# EAGLE schematic schemprzes (EAGLE 7.7.0)
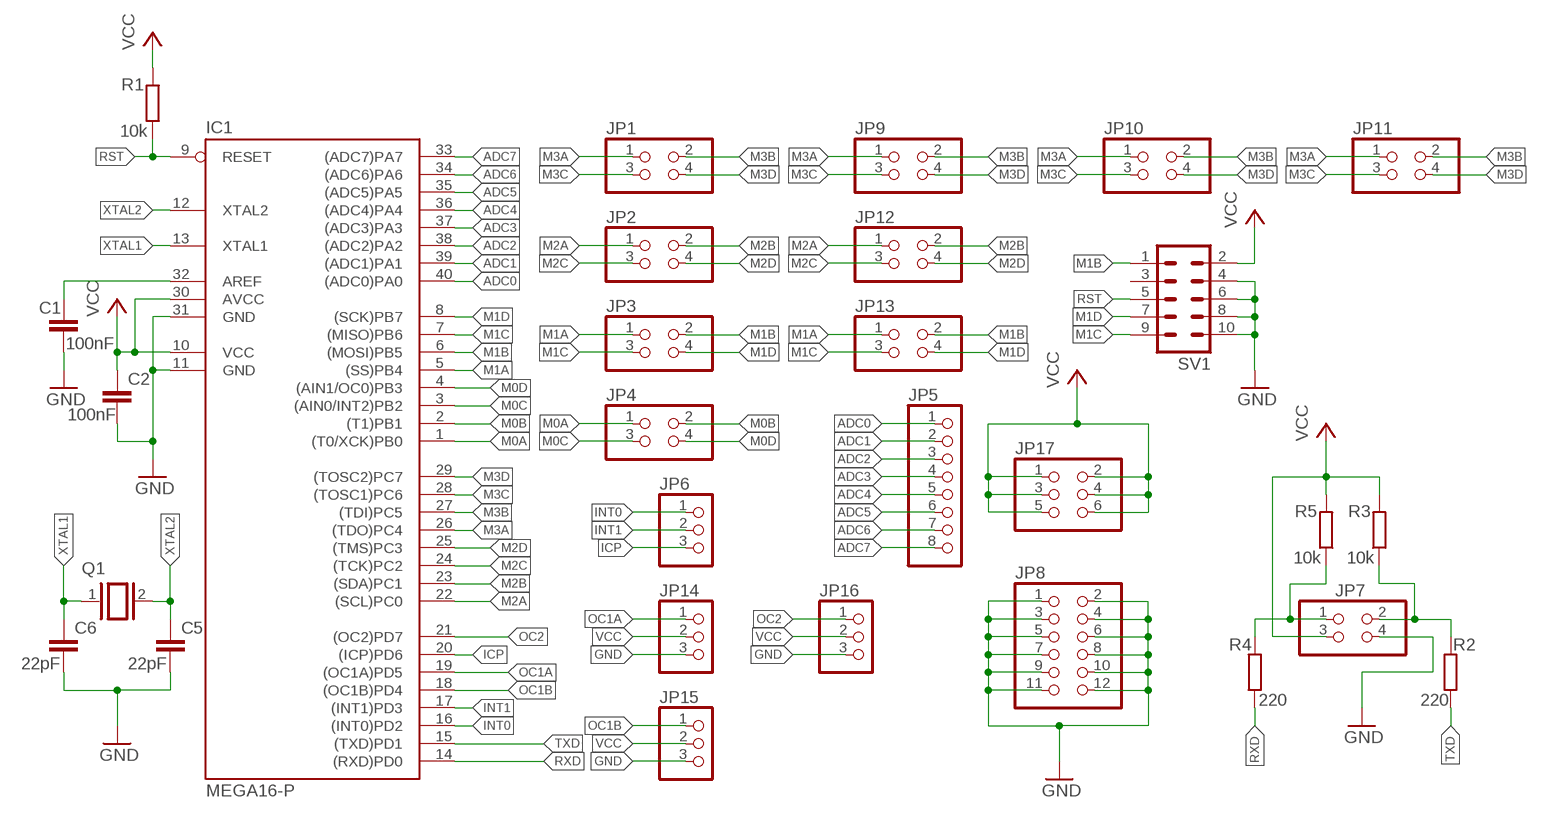
[diagram p0: schematic, sheet 1]

## Parts
C1  100nF  C-EUC0805  [C0805]
C2  100nF  C-EUC0805  [C0805]
C5  22pF  C-EUC0805  [C0805]
C6  22pF  C-EUC0805  [C0805]
IC1  MEGA16-P  [DIL40]
JP1  PINHD-2X2  [2X02]
JP2  PINHD-2X2  [2X02]
JP3  PINHD-2X2  [2X02]
JP4  PINHD-2X2  [2X02]
JP5  PINHD-1X8  [1X08]
JP6  PINHD-1X3  [1X03]
JP7  PINHD-2X2  [2X02]
JP8  PINHD-2X6  [2X06]
JP9  PINHD-2X2  [2X02]
JP10  PINHD-2X2  [2X02]
JP11  PINHD-2X2  [2X02]
JP12  PINHD-2X2  [2X02]
JP13  PINHD-2X2  [2X02]
JP14  PINHD-1X3  [1X03]
JP15  PINHD-1X3  [1X03]
JP16  PINHD-1X3  [1X03]
JP17  PINHD-2X3  [2X03]
Q1  XTAL/S  [QS]
R1  10k  R-EU_R0805  [R0805]
R2  220  R-EU_R0805  [R0805]
R3  10k  R-EU_R0805  [R0805]
R4  220  R-EU_R0805  [R0805]
R5  10k  R-EU_R0805  [R0805]
SV1  ML10  [ML10]

## Nets
ADC0: IC1.40((ADC0)PA0) JP5.1
ADC1: IC1.39((ADC1)PA1) JP5.2
ADC2: IC1.38((ADC2)PA2) JP5.3
ADC3: IC1.37((ADC3)PA3) JP5.4
ADC4: IC1.36((ADC4)PA4) JP5.5
ADC5: IC1.35((ADC5)PA5) JP5.6
ADC6: IC1.34((ADC6)PA6) JP5.7
ADC7: IC1.33((ADC7)PA7) JP5.8
GND: C1.2 C2.2 C5.2 C6.2 IC1.11(GND) IC1.31(GND) JP7.4 JP8.1 JP8.2 JP8.3 JP8.4 JP8.5 JP8.6 JP8.7 JP8.8 JP8.9 JP8.10 JP8.11 JP8.12 JP14.3 JP15.3 JP16.3 SV1.4 SV1.6 SV1.8 SV1.10
ICP: IC1.20((ICP)PD6) JP6.3
INT0: IC1.16((INT0)PD2) JP6.1
INT1: IC1.17((INT1)PD3) JP6.2
M0A: IC1.1((T0/XCK)PB0) JP4.1
M0B: IC1.2((T1)PB1) JP4.2
M0C: IC1.3((AIN0/INT2)PB2) JP4.3
M0D: IC1.4((AIN1/OC0)PB3) JP4.4
M1A: IC1.5((SS)PB4) JP3.1 JP13.1
M1B: IC1.6((MOSI)PB5) JP3.2 JP13.2 SV1.1
M1C: IC1.7((MISO)PB6) JP3.3 JP13.3 SV1.9
M1D: IC1.8((SCK)PB7) JP3.4 JP13.4 SV1.7
M2A: IC1.22((SCL)PC0) JP2.1 JP12.1
M2B: IC1.23((SDA)PC1) JP2.2 JP12.2
M2C: IC1.24((TCK)PC2) JP2.3 JP12.3
M2D: IC1.25((TMS)PC3) JP2.4 JP12.4
M3A: IC1.26((TDO)PC4) JP1.1 JP9.1 JP10.1 JP11.1
M3B: IC1.27((TDI)PC5) JP1.2 JP9.2 JP10.2 JP11.2
M3C: IC1.28((TOSC1)PC6) JP1.3 JP9.3 JP10.3 JP11.3
M3D: IC1.29((TOSC2)PC7) JP1.4 JP9.4 JP10.4 JP11.4
N$1: JP7.1 R4.2 R5.1
N$2: JP7.2 R2.2 R3.1
N$3: C1.1 IC1.32(AREF)
OC1A: IC1.19((OC1A)PD5) JP14.1
OC1B: IC1.18((OC1B)PD4) JP15.1
OC2: IC1.21((OC2)PD7) JP16.1
RST: IC1.9(RESET) R1.1 SV1.5
RXD: IC1.14((RXD)PD0) R4.1
TXD: IC1.15((TXD)PD1) R2.1
VCC: C2.1 IC1.10(VCC) IC1.30(AVCC) JP7.3 JP14.2 JP15.2 JP16.2 JP17.1 JP17.2 JP17.3 JP17.4 JP17.5 JP17.6 R1.2 R3.2 R5.2 SV1.2
XTAL1: C6.1 IC1.13(XTAL1) Q1.1
XTAL2: C5.1 IC1.12(XTAL2) Q1.2
Unconnected: SV1.3

## Library data of the parts
C1 C2 C5 C6 = resistor:C-EU: CAPACITOR, European symbol
IC1 = atmel:MEGA16-P: MICROCONTROLLER 16 Kbytes FLASH 1 kbytes SRAM 512 bytes EEPROM USART 8-channel 10 bit ADC Source: avr.lbr; MPN: ATMEGA16-16PU; OC_FARNELL: 9171142; OC_NEWARK: 01M6885
JP1-JP4 JP7 JP9-JP13 = pinhead:PINHD-2X2: PIN HEADER
JP5 = pinhead:PINHD-1X8: PIN HEADER
JP6 JP14-JP16 = pinhead:PINHD-1X3: PIN HEADER
JP8 = pinhead:PINHD-2X6: PIN HEADER
JP17 = pinhead:PINHD-2X3: PIN HEADER
Q1 = special:XTAL/S: CRYSTAL
R1-R5 = resistor:R-EU_: RESISTOR, European symbol
SV1 = con-ml:ML10: HARTING; OC_FARNELL: unknown; OC_NEWARK: unknown